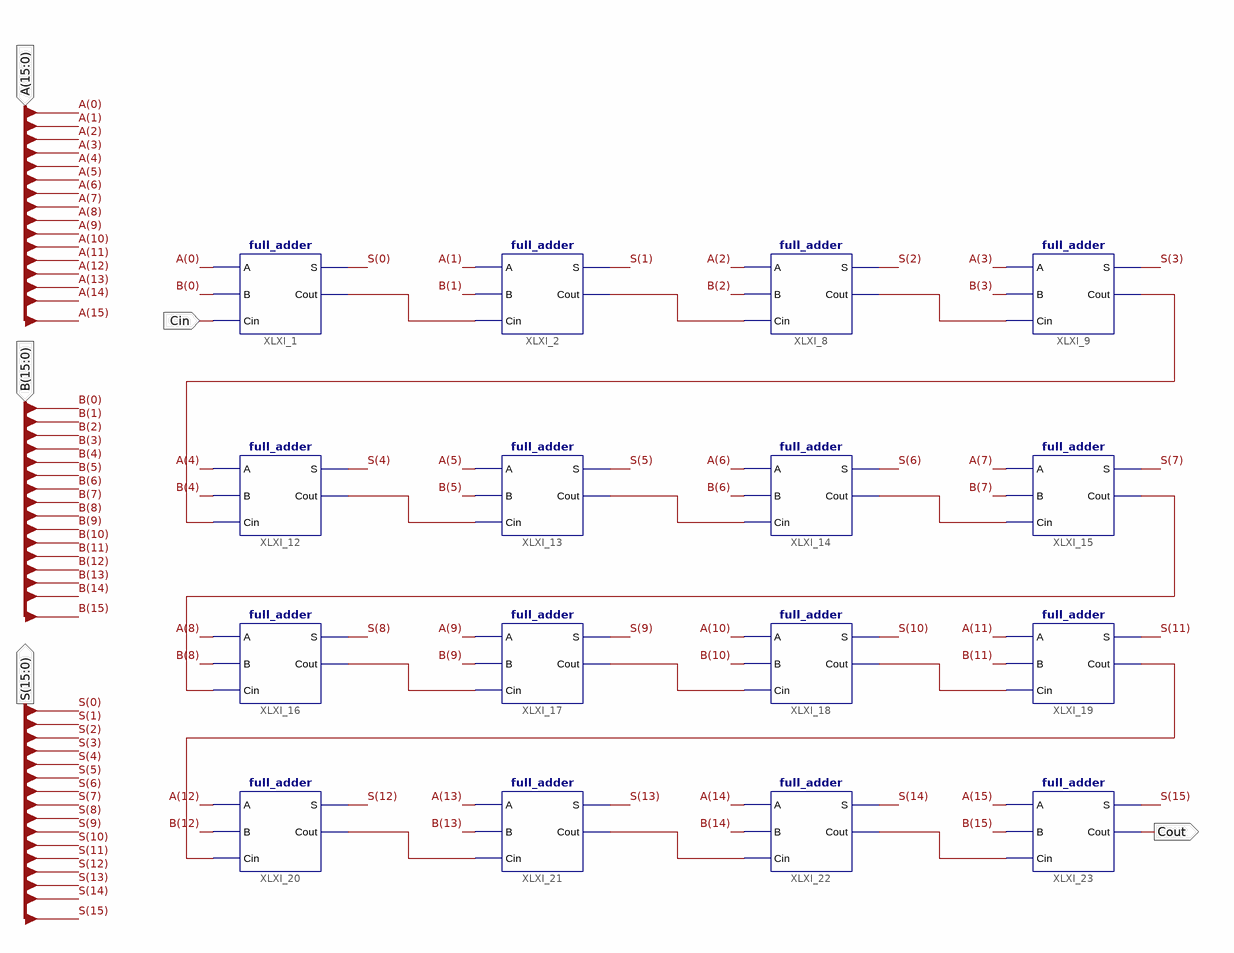
[diagram p0: schematic sheet 1]
// Xilinx ISE schematic adder_16_bit.sch (virtex6) as structural Verilog: 16 symbols, 5 ports
module adder_16_bit (
  input  [15:0] A,
  input  [15:0] B,
  input  Cin,
  output [15:0] S,
  output Cout
);

  wire XLXN_238, XLXN_239, XLXN_240, XLXN_241, XLXN_242, XLXN_243, XLXN_244, XLXN_245, XLXN_246, XLXN_247,
       XLXN_248, XLXN_249, XLXN_250, XLXN_251, XLXN_252;

  full_adder XLXI_1 (.A(A[0]), .B(B[0]), .Cin(Cin), .Cout(XLXN_238), .S(S[0]));
  full_adder XLXI_2 (.A(A[1]), .B(B[1]), .Cin(XLXN_238), .Cout(XLXN_239), .S(S[1]));
  full_adder XLXI_8 (.A(A[2]), .B(B[2]), .Cin(XLXN_239), .Cout(XLXN_240), .S(S[2]));
  full_adder XLXI_9 (.A(A[3]), .B(B[3]), .Cin(XLXN_240), .Cout(XLXN_241), .S(S[3]));
  full_adder XLXI_12 (.A(A[4]), .B(B[4]), .Cin(XLXN_241), .Cout(XLXN_242), .S(S[4]));
  full_adder XLXI_13 (.A(A[5]), .B(B[5]), .Cin(XLXN_242), .Cout(XLXN_243), .S(S[5]));
  full_adder XLXI_14 (.A(A[6]), .B(B[6]), .Cin(XLXN_243), .Cout(XLXN_244), .S(S[6]));
  full_adder XLXI_15 (.A(A[7]), .B(B[7]), .Cin(XLXN_244), .Cout(XLXN_245), .S(S[7]));
  full_adder XLXI_16 (.A(A[8]), .B(B[8]), .Cin(XLXN_245), .Cout(XLXN_246), .S(S[8]));
  full_adder XLXI_17 (.A(A[9]), .B(B[9]), .Cin(XLXN_246), .Cout(XLXN_247), .S(S[9]));
  full_adder XLXI_18 (.A(A[10]), .B(B[10]), .Cin(XLXN_247), .Cout(XLXN_248), .S(S[10]));
  full_adder XLXI_19 (.A(A[11]), .B(B[11]), .Cin(XLXN_248), .Cout(XLXN_249), .S(S[11]));
  full_adder XLXI_20 (.A(A[12]), .B(B[12]), .Cin(XLXN_249), .Cout(XLXN_250), .S(S[12]));
  full_adder XLXI_21 (.A(A[13]), .B(B[13]), .Cin(XLXN_250), .Cout(XLXN_251), .S(S[13]));
  full_adder XLXI_22 (.A(A[14]), .B(B[14]), .Cin(XLXN_251), .Cout(XLXN_252), .S(S[14]));
  full_adder XLXI_23 (.A(A[15]), .B(B[15]), .Cin(XLXN_252), .Cout(Cout), .S(S[15]));
endmodule
